# Altium schematic sheet Stepper Motor Driver With L297 - l6201PS.SchDoc
size A4
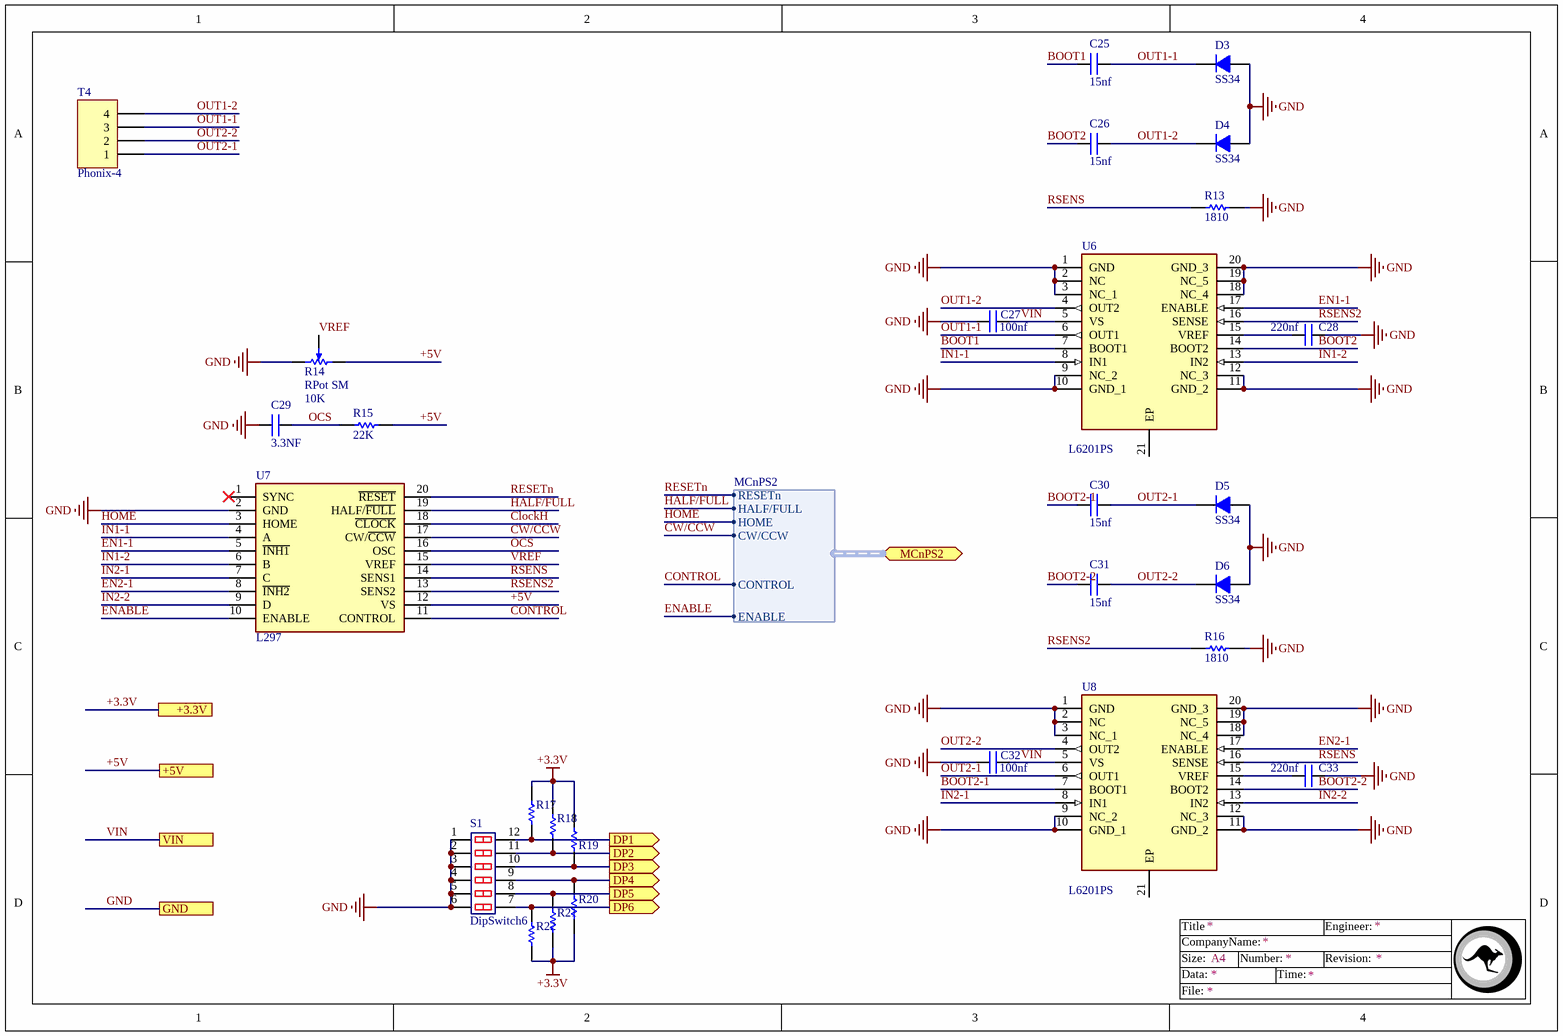
[diagram p0: Stepper Motor Driver With L297 - l6201PS.SchDoc]

## Parts
C25  15nf  [Cap0805]
C26  15nf  [Cap0805]
C27  100nf  [Cap0805]
C28  220nf  [Cap0805]
C29  3.3NF  [Cap0805]
C30  15nf  [Cap0805]
C31  15nf  [Cap0805]
C32  100nf  [Cap0805]
C33  220nf  [Cap0805]
D3  SS34  [Diod-1A-SMD]
D4  SS34  [Diod-1A-SMD]
D5  SS34  [Diod-1A-SMD]
D6  SS34  [Diod-1A-SMD]
R13  1810  [RES1812]
R14  RPot SM  value 10K  [POT4MM-Small Pot]
R15  22K  [R0805]
R16  1810  [RES1812]
R17  Resistor  [R0805]  (value not drawn)
R18  Resistor  [R0805]  (value not drawn)
R19  Resistor  [R0805]  (value not drawn)
R20  Resistor  [R0805]  (value not drawn)
R21  Resistor  [R0805]  (value not drawn)
R22  Resistor  [R0805]  (value not drawn)
S1  DipSwitch6  [DIPSW6]
T4  Phonix-4  [Phonix-4]
U6  L6201PS  [SOIC127P1420X360-21N]
U7  L297  [SOIC127P1032X265-20N]
U8  L6201PS  [SOIC127P1420X360-21N]

## Ports
+3.3V, +5V, DP1 (out), DP2 (out), DP3 (out), DP4 (out), DP5 (out), DP6 (out), GND, MCnPS2 (bidir, harness MCnPS2), VIN

## Harnesses
MCnPS2: RESETn, HALF/FULL, HOME, CW/CCW, CONTROL, ENABLE

## Nets
+3.3V: R17.1 R18.1 R19.2 R20.2 R21.2 R22.2 ; port +3.3V
GND: C27.1 C28.2 C29.2 C32.1 C33.2 D3.A D4.A D5.A D6.A R13.1 R14.CW(+) R16.1 S1.1 S1.2 S1.3 S1.4 S1.5 S1.6 U6.1(GND) U6.2(NC) U6.3(NC_1) U6.9(NC_2) U6.10(GND_1) U6.11(GND_2) U6.12(NC_3) U6.18(NC_4) U6.19(NC_5) U6.20(GND_3) U7.2(GND) U8.1(GND) U8.2(NC) U8.3(NC_1) U8.9(NC_2) U8.10(GND_1) U8.11(GND_2) U8.12(NC_3) U8.18(NC_4) U8.19(NC_5) U8.20(GND_3) ; port GND
+5V: R14.CCW(-) R15.1 U7.12(VS) ; port +5V
BOOT1: C25.2 U6.7(BOOT1)
BOOT2: C26.2 U6.14(BOOT2)
BOOT2-1: C30.2 U8.7(BOOT1)
BOOT2-2: C31.2 U8.14(BOOT2)
ClockH: U7.18(~{CLOCK})
CONTROL: U7.11(CONTROL) ; port MCnPS2.CONTROL
CW/CCW: U7.17(CW/~{CCW}) ; port MCnPS2.CW/CCW
DP1: R17.2 S1.12 ; port DP1
DP2: R18.2 S1.11 ; port DP2
DP3: R19.1 S1.10 ; port DP3
DP4: R20.1 S1.9 ; port DP4
DP5: R21.1 S1.8 ; port DP5
DP6: R22.1 S1.7 ; port DP6
EN1-1: U6.17(ENABLE) U7.5(~{INH1})
EN2-1: U7.8(~{INH2}) U8.17(ENABLE)
ENABLE: U7.10(ENABLE) ; port MCnPS2.ENABLE
HALF/FULL: U7.19(HALF/~{FULL}) ; port MCnPS2.HALF/FULL
HOME: U7.3(HOME) ; port MCnPS2.HOME
IN1-1: U6.8(IN1) U7.4(A)
IN1-2: U6.13(IN2) U7.6(B)
IN2-1: U7.7(C) U8.8(IN1)
IN2-2: U7.9(D) U8.13(IN2)
OCS: C29.1 R15.2 U7.16(OSC)
OUT1-1: C25.1 D3.K T4.3 U6.6(OUT1)
OUT1-2: C26.1 D4.K T4.4 U6.4(OUT2)
OUT2-1: C30.1 D5.K T4.1 U8.6(OUT1)
OUT2-2: C31.1 D6.K T4.2 U8.4(OUT2)
RESETn: U7.20(~{RESET}) ; port MCnPS2.RESETn
RSENS: R13.2 U7.14(SENS1) U8.16(SENSE)
RSENS2: R16.2 U6.16(SENSE) U7.13(SENS2)
VIN: C27.2 C32.2 U6.5(VS) U8.5(VS) ; port VIN
VREF: R14.W U7.15(VREF)
NetC28_1: C28.1 U6.15(VREF)
NetC33_1: C33.1 U8.15(VREF)

Not connected (* = marked no-connect by the designer): U6 21(EP); U7 1(SYNC)*; U8 21(EP)

## Notes on the sheet
- Title
- Size:
- Data:
- CompanyName:
- A4
- Number:
- Time:
- Revision:
- Engineer:
- File:

## Library data of the parts
C25-C33 = Cap: Surface mount Capacitor
D3-D6 = Diode
R13 R15 R16 = Resistor
R14 = RPot SM: Square Trimming Potentiometer; Published: 17-Dec-2003; DatasheetVersion: Oct-2003; PackageReference: POT4MM-2; Publisher: Altium Limited; PackageDescription: Square Trimming Potentiometer; ComponentLink1Description: Manufacturer Link; ComponentLink1URL: http://bourns.com/2/search.html
S1 = DipSwitch6: DipSwitch6pin
T4 = Phonix-4: Connector
U6 U8 = L6201PS: High voltage, high current dual full-bridge driver
U7 = L297: Stepper Motor Controller IC